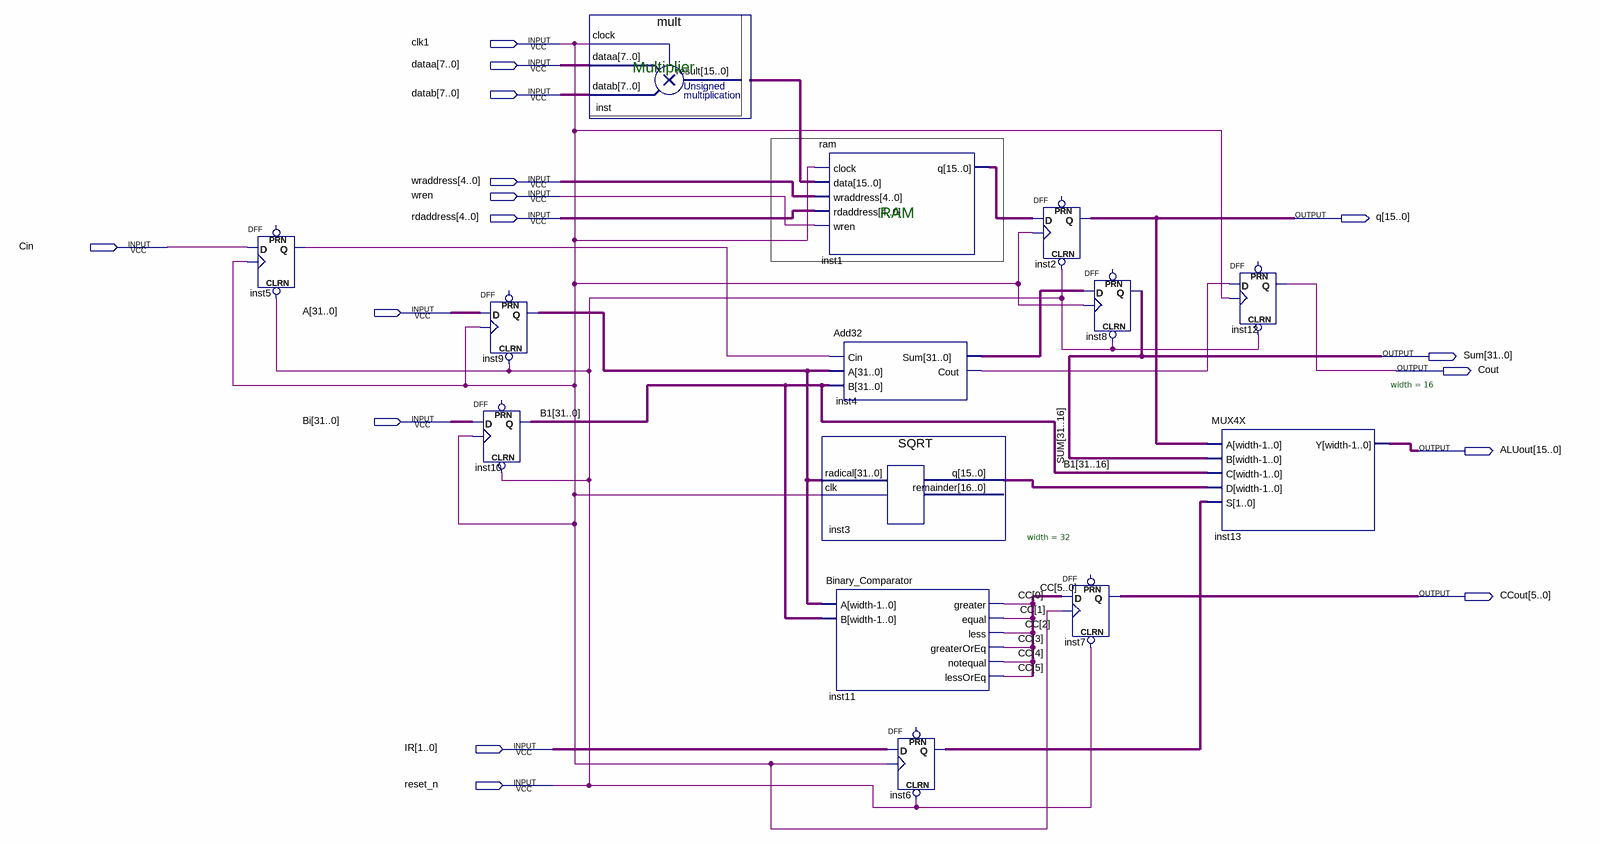
[diagram p0: schematic sheet]
// Quartus schematic pipemult.bdf as structural Verilog: 14 symbols, 16 pins
module pipemult (
  input  clk1,
  input  [7:0] dataa,
  input  [7:0] datab,
  input  [4:0] wraddress,
  input  wren,
  input  [4:0] rdaddress,
  input  Cin,
  input  [31:0] A,
  input  [31:0] Bi,
  input  [1:0] IR,
  input  reset_n,
  output [15:0] q,
  output [31:0] Sum,
  output Cout,
  output [15:0] ALUout,
  output [5:0] CCout
);

  wire inst4_cout, inst5_q;
  wire [1:0] inst6_q;
  wire [5:0] CC;
  wire [15:0] inst1_q, inst3_q, inst_result;
  wire [31:0] B1, inst4_sum, inst9_q;

  DFF inst5 (.CLRN(reset_n), .CLK(clk1), .D(Cin), .Q(inst5_q));  // open: PRN
  DFF inst10[31:0] (.CLRN(reset_n), .CLK(clk1), .D(Bi), .Q(B1));  // open: PRN
  DFF inst9[31:0] (.CLRN(reset_n), .CLK(clk1), .D(A), .Q(inst9_q));  // open: PRN
  mult inst (.clock(clk1), .dataa(dataa), .datab(datab), .result(inst_result));
  ram inst1 (.clock(clk1), .data(inst_result), .wraddress(wraddress), .rdaddress(rdaddress), .wren(wren), .q(inst1_q));
  SQRT inst3 (.radical(inst9_q), .clk(clk1), .q(inst3_q));  // open: remainder
  Binary_Comparator #(.width(32)) inst11 (
    .A(inst9_q), .B(B1), .greater(CC[0]), .equal(CC[1]), .less(CC[2]), .greaterOrEq(CC[3]), .notequal(CC[4]),
    .lessOrEq(CC[5]));
  Add32 inst4 (.Cin(inst5_q), .A(inst9_q), .B(B1), .Sum(inst4_sum), .Cout(inst4_cout));
  DFF inst6[1:0] (.CLRN(reset_n), .CLK(clk1), .D(IR), .Q(inst6_q));  // open: PRN
  DFF inst2[15:0] (.CLRN(reset_n), .CLK(clk1), .D(inst1_q), .Q(q));  // open: PRN
  DFF inst8[31:0] (.CLRN(reset_n), .CLK(clk1), .D(inst4_sum), .Q(Sum));  // open: PRN
  DFF inst7[5:0] (.CLRN(reset_n), .CLK(clk1), .D(CC), .Q(CCout));  // open: PRN
  DFF inst12 (.CLRN(reset_n), .CLK(clk1), .D(inst4_cout), .Q(Cout));  // open: PRN
  MUX4X #(.width(16)) inst13 (.A(q), .B(Sum[31:16]), .C(B1[31:16]), .D(inst3_q), .S(inst6_q), .Y(ALUout));

  // Notes on the sheet:
  //   Multiplier
  //   RAM
endmodule
